# Altium schematic sheet 001.Revision.SchDoc
size A4
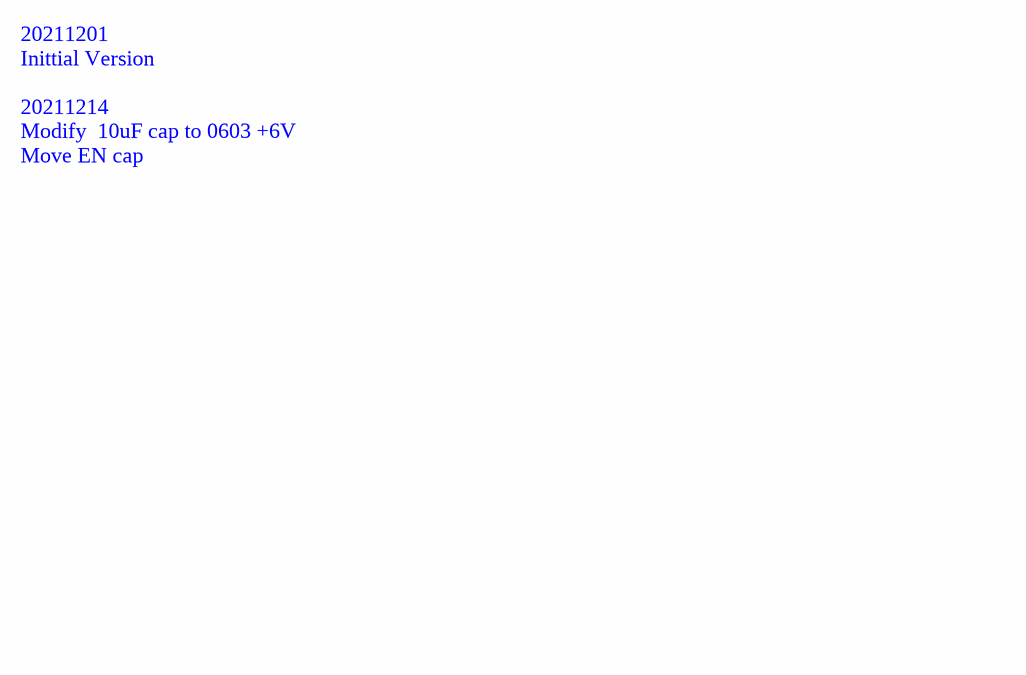
[diagram p0: 001.Revision.SchDoc]

## Notes on the sheet
- 20211201
  Inittial Version
  20211214
  Modify  10uF cap to 0603 +6V
  Move EN cap